# Altium schematic sheet ICM-42670-P_IMU.SchDoc
size A; SheetNumber: 3; SheetTotal: 4
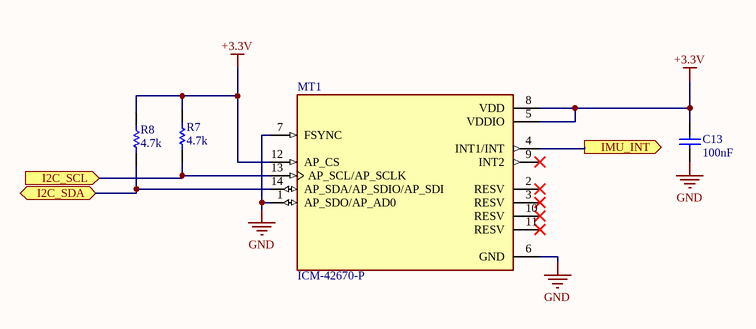
[diagram p0: ICM-42670-P_IMU.SchDoc]

## Parts
C13  value 100nF  [CAPC1005X55N]  (hidden comment: Cap)
MT1  ICM-42670-P  [XDCR_ICM-42670-P]
R7  value 4.7k  [RESC1005X40]  (hidden comment: Res1)
R8  value 4.7k  [RESC1005X40]  (hidden comment: Res1)

## Ports
I2C_SCL (in), I2C_SDA (bidir), IMU_INT (out)

## Nets
+3.3V: C13.2 MT1.5(VDDIO) MT1.8(VDD) MT1.12(AP_CS) R7.2 R8.2
GND: C13.1 MT1.1(AP_SDO/AP_AD0) MT1.6(GND) MT1.7(FSYNC)
I2C_SCL: MT1.13(AP_SCL/AP_SCLK) R7.1 ; port I2C_SCL
I2C_SDA: MT1.14(AP_SDA/AP_SDIO/AP_SDI) R8.1 ; port I2C_SDA
IMU_INT: MT1.4(INT1/INT) ; port IMU_INT

Not connected (* = marked no-connect by the designer): MT1 2(RESV)* 3(RESV)* 9(INT2)* 10(RESV)* 11(RESV)*

## Library data of the parts
C13 = Cap: Capacitor; Published: 8-Jun-2000; LatestRevisionDate: 17-Jul-2002; LatestRevisionNote: Re-released for DXP Platform.; PackageReference: RAD-0.3; Publisher: Altium Limited; PackageDescription: Radial Cap, Thru-Hole; 2 Leads; 0.3 in Pin Spacing
R7 R8 = Res1: Resistor; Published: 8-Jun-2000; LatestRevisionDate: 17-Jul-2002; LatestRevisionNote: Re-released for DXP Platform.; PackageReference: AXIAL-0.3; Publisher: Altium Limited; PackageDescription: Axial Device, Thru-Hole; 2 Leads; 0.3 in Pin Spacing
MT1 = ICM-42670-P: Package: None; Price: None; Value: *; MP: ICM-42670-P; Availability: Unavailable